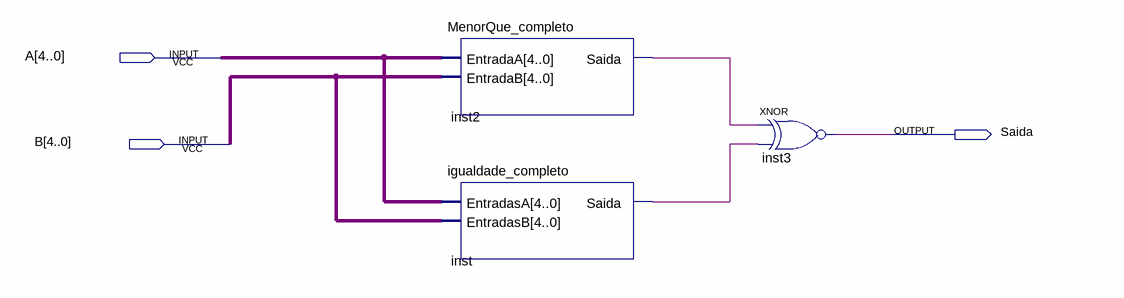
[diagram p0: schematic sheet]
// Quartus schematic MaiorQue_completo.bdf as structural Verilog: 3 symbols, 3 pins
module MaiorQue_completo (
  input  [4:0] A,
  input  [4:0] B,
  output Saida
);

  wire inst2_saida, inst_saida;

  MenorQue_completo inst2 (.EntradaA(A), .EntradaB(B), .Saida(inst2_saida));
  igualdade_completo inst (.EntradasA(A), .EntradasB(B), .Saida(inst_saida));
  xnor inst3 (Saida, inst2_saida, inst_saida);
endmodule
